# EAGLE design AtTiny85 (EAGLE 7.2.0)
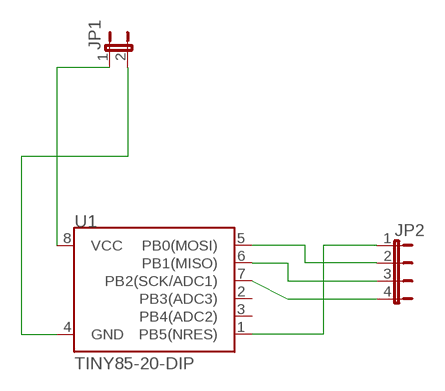
[diagram p0: schematic, sheet 1]

## Parts
JP1  JP1E  [JP1]
JP2  JP4E  [JP4]
U1  TINY85-20-DIP  ATTINY45TINY85-20-DIP  [DIP08]

## Nets
N$1: JP1.1 U1.8(VCC)
N$2: JP1.2 U1.4(GND)
N$3: JP2.1 U1.1(PB5(NRES))
N$4: JP2.2 U1.5(PB0(MOSI))
N$5: JP2.3 U1.6(PB1(MISO))
N$6: JP2.4 U1.7(PB2(SCK/ADC1))
Unconnected: U1.2(PB3(ADC3)) U1.3(PB4(ADC2))

## Library data of the parts
JP1 = jumper:JP1E: JUMPER
JP2 = jumper:JP4E: JUMPER
U1 = SparkFun-DigitalIC:ATTINY45: Atmel 8-pin 2/4/8kB flash uC; PROD_ID: IC-09445

## Board
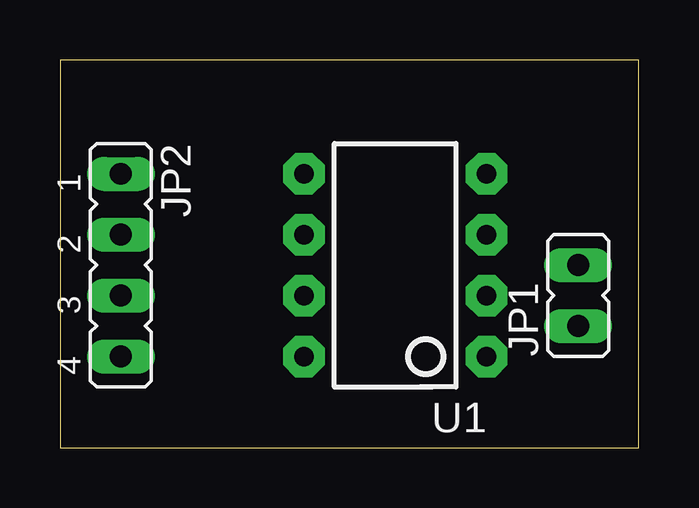
[diagram p1: board, top side]
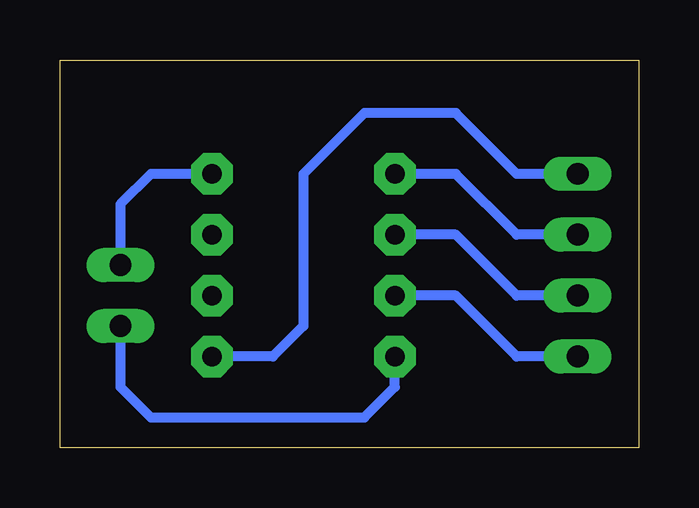
[diagram p2: board, bottom side, seen from below]

Size 24.11 x 16.18 mm. Coordinates in mm from the lower left corner, seen from the top.
Outline: 0,0 24.11,0 24.11,16.18 0,16.18 0,0
Copper layers (1*16): Top 0.035mm / dielectric 1.5mm / Bottom 0.035mm
Design rules "default": minimum track width 10mil, minimum drill 24mil, track to track 8mil, track to pad 8mil, pad to pad 8mil, via to via 8mil, smd to smd 8mil, copper to edge 40mil, drill to drill 8mil, minimum pad ring 10mil, minimum via ring 8mil, stop-mask expansion 4mil, vias tented up to drill 0mil, thermal gap 10mil

### Footprints (pad centres in the part's own frame; a part is rotated, then mirrored left to right if it is on the bottom)
JP1 = drill 0.914 long: 1 0,-1.27; 2 0,1.27
JP4 = drill 0.914 long: 1 -3.81,0; 2 -1.27,0; 3 1.27,0; 4 3.81,0
DIP08 = drill 0.813 pad 1.727 octagon: 1 -3.81,-3.81; 2 -1.27,-3.81; 3 1.27,-3.81; 4 3.81,-3.81; 5 3.81,3.81; 6 1.27,3.81; 7 -1.27,3.81; 8 -3.81,3.81

### Placement (x,y rotation side)
JP1  21.59,6.35 0 top
JP2  2.54,7.62 270 top
U1  13.97,7.62 90 top

### Tracks (layer width: path | path; a pad name or v marks a point on that pad's centre or on a via)
N$1
  Bottom 0.406: JP1.1 21.59,2.54 20.32,1.27 11.43,1.27 10.16,2.54 U1.8
N$2
  Bottom 0.406: U1.4 20.32,11.43 21.59,10.16 JP1.2
N$3
  Bottom 0.406: JP2.1 5.08,11.43 7.62,13.97 11.43,13.97 13.97,11.43 13.97,5.08 15.24,3.81 U1.1
N$4
  Bottom 0.406: JP2.2 5.08,8.89 7.62,11.43 U1.5
N$5
  Bottom 0.406: JP2.3 5.08,6.35 7.62,8.89 U1.6
N$6
  Bottom 0.406: JP2.4 5.08,3.81 7.62,6.35 U1.7